# Altium schematic sheet SAMV71_Xplained_Ultra_Connectors.SchDoc: Extension connectors
size A3; Organization: ATMEL Norway; Address1: Vestre Rosten 79; Address2: N-7075 TILLER; Address3: NORWAY; DocumentNumber: A09-2407; Revision: 2; SheetNumber: 7; SheetTotal: 13; PageSetup: Record=PageOptions|CenterHorizontal=True|CenterVertical=True|PrintScale=1.01|XCorrection=1.00|YCorrection=1.00|PrintKind=1|BorderSize=5000000|LeftOffset=0|BottomOffset=0|Orientation=2|PaperLength=1000|PaperWidth=1000|Scale=100|PaperSource=7|PrintQuality=-4|MediaType=1|DitherType=10|PrintScaleMode=1|PaperKind=A3 (297 x 420 mm)|PaperIndex=9
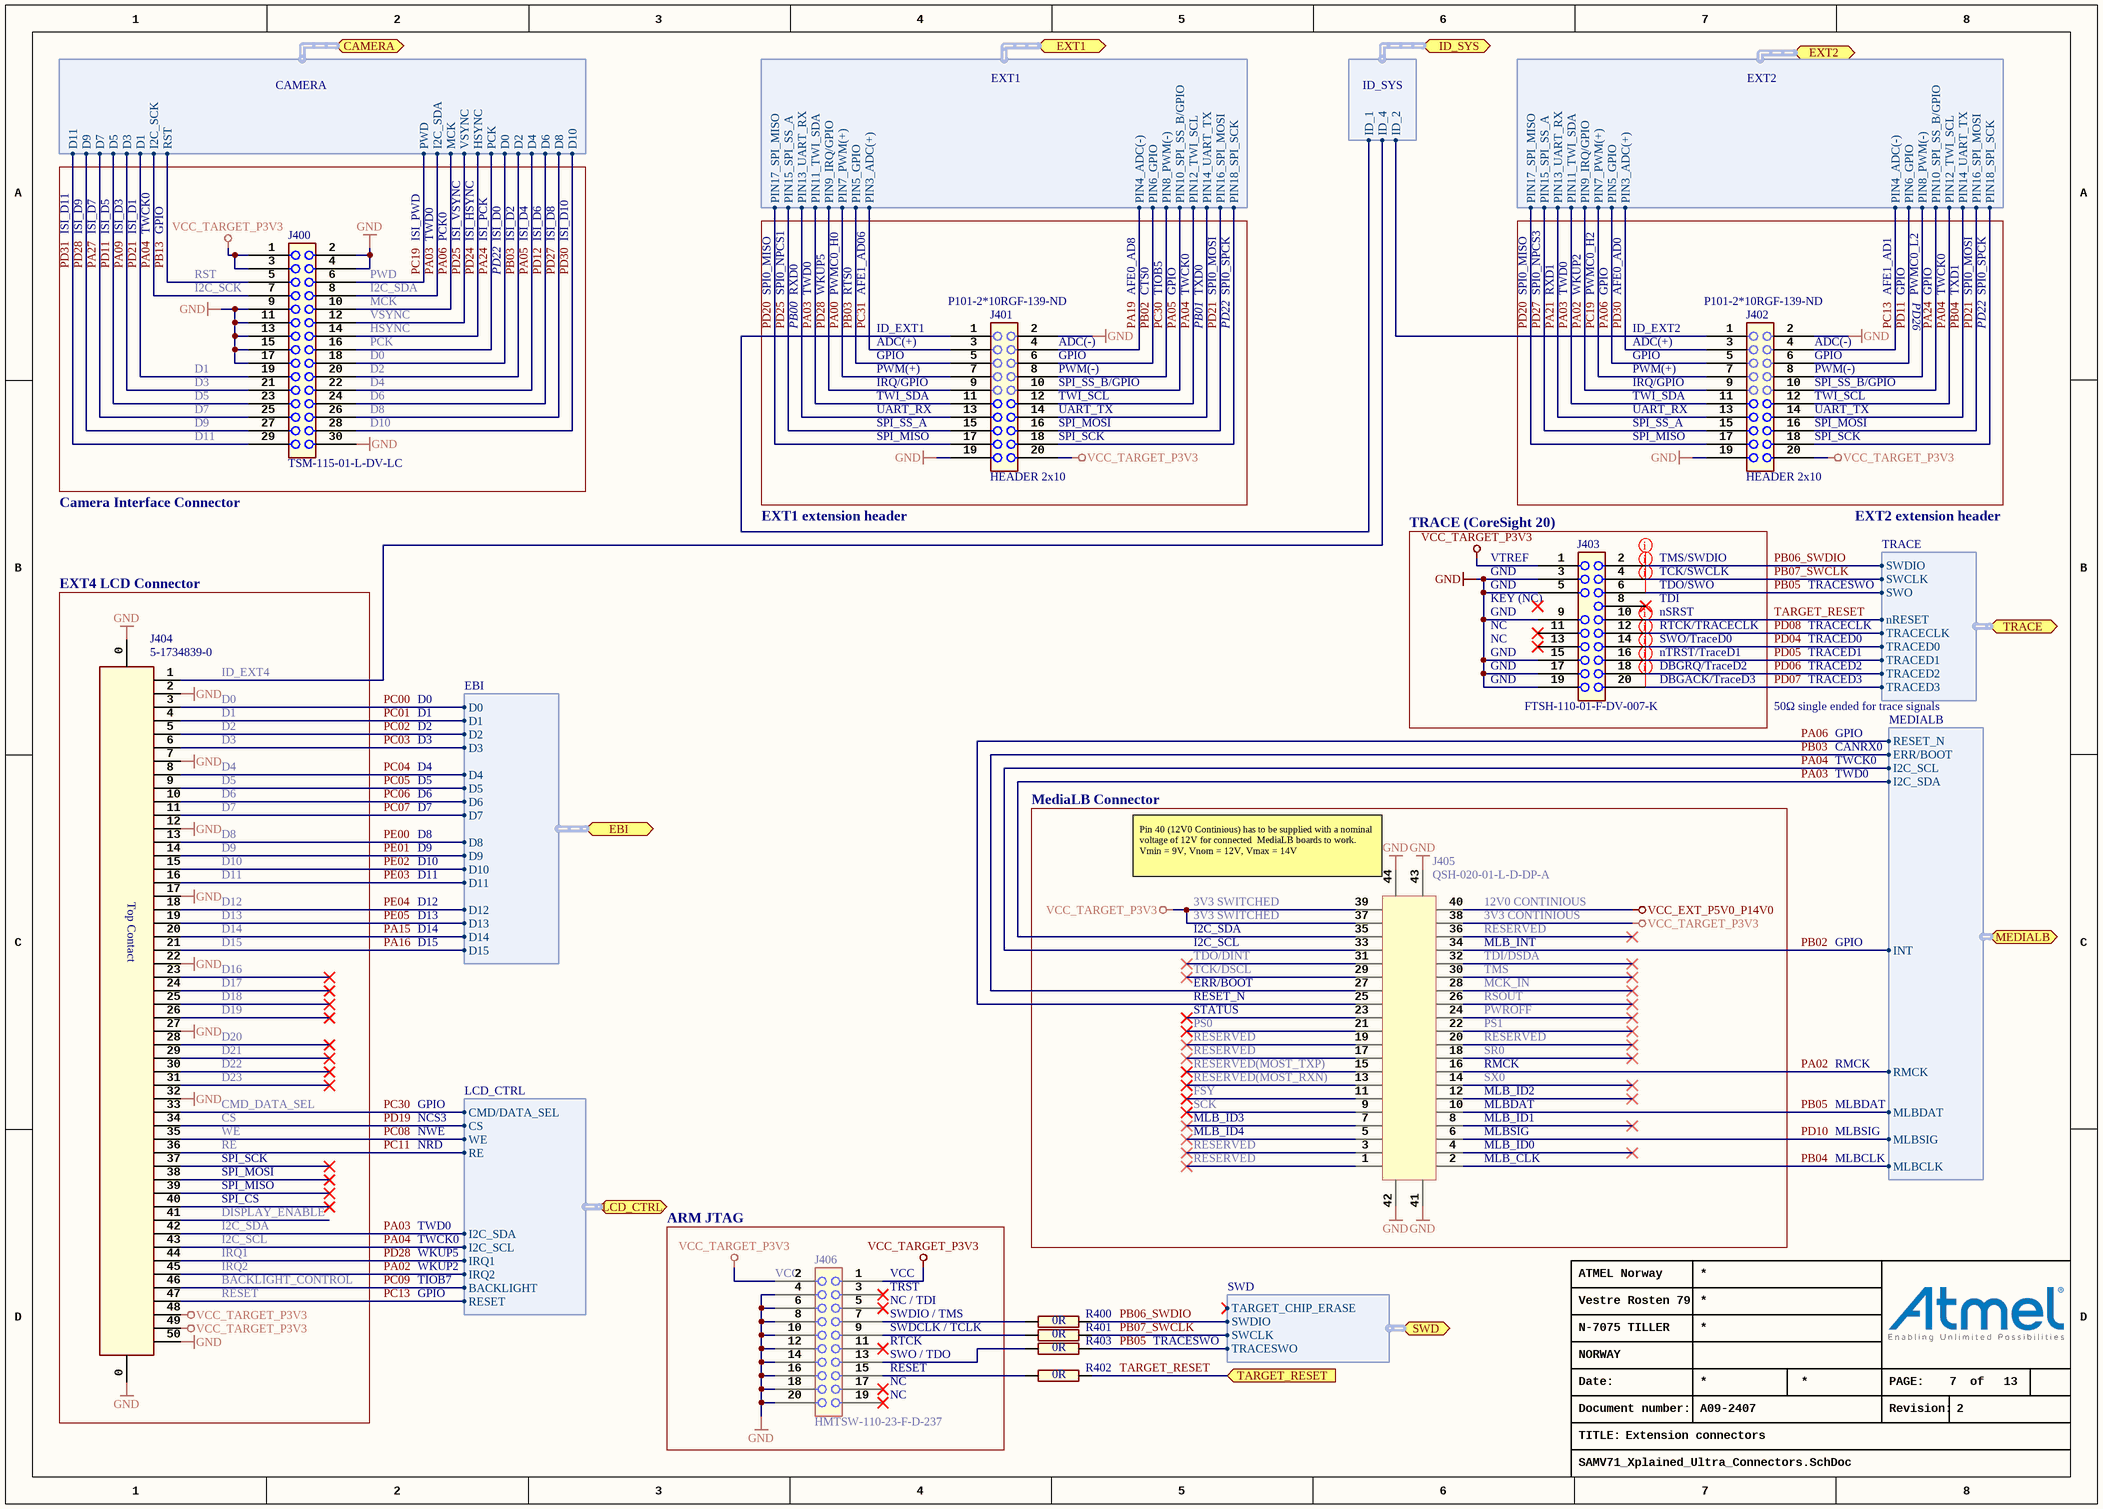
[diagram p0: SAMV71_Xplained_Ultra_Connectors.SchDoc]

## Parts
J400  value TSM-115-01-L-DV-LC  [AP8-00884]  (hidden comment: HEADER 2x15)
J401  HEADER 2x10  value P101-2*10RGF-139-ND  [AP8-00622]
J402  HEADER 2x10  value P101-2*10RGF-139-ND  [AP8-00622]
J403  FTSH-110-01-F-DV-007-K  [AP8-00910]
J404  value 5-1734839-0  [AP8-00774]  (hidden comment: Used for Xplained Pro MCU board on top layer.)
J405  value QSH-020-01-L-D-DP-A  [AP8-00878]
J406  value HMTSW-110-23-F-D-237  [AP8-00744]  (hidden comment: Same as A08-1514 but with 1mm hole)
R400  value 0R  [AP2-00000]  (hidden comment: R2)
R401  value 0R  [AP2-00000]  (hidden comment: R2)
R402  value 0R  [AP2-00000]  (hidden comment: R2)
R403  value 0R  [AP2-00000]  (hidden comment: R2)

## Blocks framed on the sheet
TRACE (CoreSight 20): J403
EXT4 LCD Connector: J404
MediaLB Connector: J405
ARM JTAG: J406

## Ports
CAMERA (harness CAMERA), EBI (harness EBI), EXT1 (harness EXT1), EXT2 (harness EXT2), ID_SYS (harness ID_SYS), LCD_CTRL (harness LCD_CTRL), MEDIALB (harness MEDIALB), SWD (harness SWD), TARGET_RESET (in), TRACE (harness TRACE)

## Harnesses
ID_SYS: ID_1, ID_2, ID_4
EXT1: PIN3_ADC(+), PIN4_ADC(-), PIN5_GPIO, PIN6_GPIO, PIN7_PWM(+), PIN8_PWM(-), PIN9_IRQ/GPIO, PIN10_SPI_SS_B/GPIO, PIN11_TWI_SDA, PIN12_TWI_SCL, PIN13_UART_RX, PIN14_UART_TX, PIN15_SPI_SS_A, PIN16_SPI_MOSI, PIN17_SPI_MISO, PIN18_SPI_SCK
EXT2: PIN3_ADC(+), PIN4_ADC(-), PIN5_GPIO, PIN6_GPIO, PIN7_PWM(+), PIN8_PWM(-), PIN9_IRQ/GPIO, PIN10_SPI_SS_B/GPIO, PIN11_TWI_SDA, PIN12_TWI_SCL, PIN13_UART_RX, PIN14_UART_TX, PIN15_SPI_SS_A, PIN16_SPI_MOSI, PIN17_SPI_MISO, PIN18_SPI_SCK
EBI: D0, D1, D2, D3, D4, D5, D6, D7, D8, D9, D10, D11, D12, D13, D14, D15
CAMERA: MCK, VSYNC, HSYNC, PCK, D0, D1, D2, D3, D4, D5, D6, D7, D8, D9, D10, D11, I2C_SCK, I2C_SDA, RST, PWD
TRACE: SWDIO, SWCLK, TRACECLK, TRACED0, TRACED1, TRACED2, TRACED3, nRESET, SWO
LCD_CTRL: CMD/DATA_SEL, CS, WE, RE, I2C_SDA, I2C_SCL, IRQ1, IRQ2, BACKLIGHT, RESET
MEDIALB: MLBSIG, MLBDAT, MLBCLK, I2C_SDA, I2C_SCL, INT, ERR/BOOT, RESET_N, RMCK
SWD: SWCLK, SWDIO, TARGET_CHIP_ERASE, TRACESWO

## Nets
GND: J400.2 J400.4 J400.9 J400.11 J400.13 J400.15 J400.17 J400.30 J401.2 J401.19 J402.2 J402.19 J403.3 J403.5 J403.9 J403.15 J403.17 J403.19 J404.0 J404.2 J404.7 J404.12 J404.17 J404.22 J404.27 J404.32 J404.50 J405.41 J405.42 J405.43 J405.44 J406.4 J406.6 J406.8 J406.10 J406.12 J406.14 J406.16 J406.18 J406.20
VCC_EXT_P5V0_P14V0: J405.40
VCC_TARGET_P3V3: J400.1 J400.3 J401.20 J402.20 J403.1 J404.48 J404.49 J405.37 J405.38 J405.39 J406.1 J406.2
PA00: J401.7 ; port EXT1.PIN7_PWM(+)
PA02: J402.9 J404.45 J405.16 ; port EXT2.PIN9_IRQ/GPIO, port LCD_CTRL.IRQ2, port MEDIALB.RMCK
PA03: J400.8 J401.11 J402.11 J404.42 J405.35 ; port EXT1.PIN11_TWI_SDA, port EXT2.PIN11_TWI_SDA, port CAMERA.I2C_SDA, port LCD_CTRL.I2C_SDA, port MEDIALB.I2C_SDA
PA04: J400.7 J401.12 J402.12 J404.43 J405.33 ; port EXT1.PIN12_TWI_SCL, port EXT2.PIN12_TWI_SCL, port CAMERA.I2C_SCK, port LCD_CTRL.I2C_SCL, port MEDIALB.I2C_SCL
PA05: J400.22 J401.10 ; port EXT1.PIN10_SPI_SS_B/GPIO, port CAMERA.D4
PA06: J400.10 J402.5 J405.25 ; port EXT2.PIN5_GPIO, port CAMERA.MCK, port MEDIALB.RESET_N
PA09: J400.21 ; port CAMERA.D3
PA15: J404.20 ; port EBI.D14
PA16: J404.21 ; port EBI.D15
PA19: J401.4 ; port EXT1.PIN4_ADC(-)
PA21: J402.13 ; port EXT2.PIN13_UART_RX
PA24: J400.16 J402.10 ; port EXT2.PIN10_SPI_SS_B/GPIO, port CAMERA.PCK
PA27: J400.25 ; port CAMERA.D7
PB02: J401.6 J405.34 ; port EXT1.PIN6_GPIO, port MEDIALB.INT
PB03: J400.20 J401.5 J405.27 ; port EXT1.PIN5_GPIO, port CAMERA.D2, port MEDIALB.ERR/BOOT
PB04: J402.14 J405.2 ; port EXT2.PIN14_UART_TX, port MEDIALB.MLBCLK
PB05: J403.6 J405.10 R403.2 ; port TRACE.SWO, port MEDIALB.MLBDAT, port SWD.TRACESWO
PB06_SWDIO: J403.2 R400.2 ; port TRACE.SWDIO, port SWD.SWDIO
PB07_SWCLK: J403.4 R401.2 ; port TRACE.SWCLK, port SWD.SWCLK
PB13: J400.5 ; port CAMERA.RST
PC00: J404.3 ; port EBI.D0
PC01: J404.4 ; port EBI.D1
PC02: J404.5 ; port EBI.D2
PC03: J404.6 ; port EBI.D3
PC04: J404.8 ; port EBI.D4
PC05: J404.9 ; port EBI.D5
PC06: J404.10 ; port EBI.D6
PC07: J404.11 ; port EBI.D7
PC08: J404.35 ; port LCD_CTRL.WE
PC09: J404.46 ; port LCD_CTRL.BACKLIGHT
PC11: J404.36 ; port LCD_CTRL.RE
PC13: J402.4 J404.47 ; port EXT2.PIN4_ADC(-), port LCD_CTRL.RESET
PC19: J400.6 J402.7 ; port EXT2.PIN7_PWM(+), port CAMERA.PWD
PC30: J401.8 J404.33 ; port EXT1.PIN8_PWM(-), port LCD_CTRL.CMD/DATA_SEL
PC31: J401.3 ; port EXT1.PIN3_ADC(+)
PD04: J403.14 ; port TRACE.TRACED0
PD05: J403.16 ; port TRACE.TRACED1
PD06: J403.18 ; port TRACE.TRACED2
PD07: J403.20 ; port TRACE.TRACED3
PD08: J403.12 ; port TRACE.TRACECLK
PD10: J405.6 ; port MEDIALB.MLBSIG
PD11: J400.23 J402.6 ; port EXT2.PIN6_GPIO, port CAMERA.D5
PD12: J400.24 ; port CAMERA.D6
PD19: J404.34 ; port LCD_CTRL.CS
PD20: J401.17 J402.17 ; port EXT1.PIN17_SPI_MISO, port EXT2.PIN17_SPI_MISO
PD21: J400.19 J401.16 J402.16 ; port EXT1.PIN16_SPI_MOSI, port EXT2.PIN16_SPI_MOSI, port CAMERA.D1
PD24: J400.14 ; port CAMERA.HSYNC
PD25: J400.12 J401.15 ; port EXT1.PIN15_SPI_SS_A, port CAMERA.VSYNC
PD27: J400.26 J402.15 ; port EXT2.PIN15_SPI_SS_A, port CAMERA.D8
PD28: J400.27 J401.9 J404.44 ; port EXT1.PIN9_IRQ/GPIO, port CAMERA.D9, port LCD_CTRL.IRQ1
PD30: J400.28 J402.3 ; port EXT2.PIN3_ADC(+), port CAMERA.D10
PD31: J400.29 ; port CAMERA.D11
PE00: J404.13 ; port EBI.D8
PE01: J404.14 ; port EBI.D9
PE02: J404.15 ; port EBI.D10
PE03: J404.16 ; port EBI.D11
PE04: J404.18 ; port EBI.D12
PE05: J404.19 ; port EBI.D13
TARGET_RESET: J403.10 R402.2 ; port TARGET_RESET, port TRACE.nRESET
NetJ400_18: J400.18 ; port CAMERA.D0
NetJ401_1: J401.1 ; port ID_SYS.ID_1
NetJ401_13: J401.13 ; port EXT1.PIN13_UART_RX
NetJ401_14: J401.14 ; port EXT1.PIN14_UART_TX
NetJ401_18: J401.18 ; port EXT1.PIN18_SPI_SCK
NetJ402_1: J402.1 ; port ID_SYS.ID_2
NetJ402_8: J402.8 ; port EXT2.PIN8_PWM(-)
NetJ402_18: J402.18 ; port EXT2.PIN18_SPI_SCK
NetJ404_1: J404.1 ; port ID_SYS.ID_4
NetJ406_7: J406.7 R400.1
NetJ406_9: J406.9 R401.1
NetJ406_13: J406.13 R403.1
NetJ406_15: J406.15 R402.1

Not connected (* = marked no-connect by the designer): J403 8* 11* 13*; J404 23* 24* 25* 26* 28* 29* 30* 31* 37* 38* 39* 40* 41; J405 1* 3* 4* 5* 7* 8* 9* 11* 12* 13* 14* 15* 17* 18* 19* 20* 21* 22* 23* 24* 26* 28* 29* 30* 31* 32* 36*; J406 3* 5* 11* 17* 19*

## Layout directives
net class TRACE: PB05, PB06_SWDIO, PB07_SWCLK, PD04, PD05, PD06, PD07, PD08

## Notes on the sheet
- ISI_D11
- ISI_D9
- ISI_D7
- ISI_D5
- ISI_D3
- ISI_D1
- TWCK0
- GPIO
- ISI_PWD
- TWD0
- PCK0
- ISI_VSYNC
- ISI_HSYNC
- ISI_PCK
- ISI_D0
- ISI_D2
- ISI_D4
- ISI_D6
- ISI_D8
- ISI_D10
- RST
- (near J400) I2C_SCK
- PWD
- I2C_SDA
- MCK
- VSYNC
- PD22
- SPI0_MISO
- SPI0_NPCS1
- RXD0
- WKUP5
- PWMC0_H0
- RTS0
- AFE1_AD06
- AFE0_AD8
- CTS0
- TIOB5
- TXD0
- SPI0_MOSI
- SPI0_SPCK
- SPI0_NPCS3
- RXD1
- WKUP2
- PWMC0_H2
- AFE0_AD0
- AFE1_AD1
- PD26
- PWMC0_L2
- TXD1
- D1
- HSYNC
- PCK
- D0
- D2
- PB00
- ID_EXT1
- ADC(+)
- PWM(+)
- (near J401) ADC(-)
- (near J401) GPIO
- (near J401) PWM(-)
- PB01
- ID_EXT2
- (near J402) ADC(-)
- (near J402) GPIO
- (near J402) PWM(-)
- D3
- D5
- D7
- D9
- D11
- D4
- D6
- D8
- D10
- IRQ/GPIO
- TWI_SDA
- UART_RX
- SPI_SS_A
- SPI_MISO
- (near J401) SPI_SS_B/GPIO
- (near J401) TWI_SCL
- (near J401) UART_TX
- (near J401) SPI_MOSI
- (near J401) SPI_SCK
- (near J402) SPI_SS_B/GPIO
- (near J402) TWI_SCL
- (near J402) UART_TX
- (near J402) SPI_MOSI
- (near J402) SPI_SCK
- Camera Interface Connector
- EXT1 extension header
- VTREF
- GND
- TMS/SWDIO
- TCK/SWCLK
- TDO/SWO
- TRACESWO
- EXT2 extension header
- (near J403) KEY (NC)
- NC
- TDI
- nSRST
- SWO/TraceD0
- RTCK/TRACECLK
- TRACECLK
- TRACED0
- ID_EXT4
- nTRST/TraceD1
- DBGRQ/TraceD2
- DBGACK/TraceD3
- 50Ω single ended for trace signals
- TRACED1
- TRACED2
- TRACED3
- CANRX0
- D12
- D13
- (near J405) Pin 40 (12V0 Continious) has to be supplied with a nominal voltage of 12V for connected  MediaLB boards to work.  Vmin = 9V, Vnom = 12V, Vmax = 14V
- 3V3 SWITCHED
- (near J405) 3V3 CONTINIOUS
- (near J405) 12V0 CONTINIOUS
- D14
- D15
- D16
- D17
- TCK/DSCL
- TDO/DINT
- ERR/BOOT
- I2C_SCL
- (near J405) TMS
- (near J405) TDI/DSDA
- (near J405) RESERVED
- (near J405) MCK_IN
- (near J405) MLB_INT
- D18
- D19
- D20
- D21
- RESERVED
- PS0
- STATUS
- RESET_N
- (near J405) SR0
- (near J405) RSOUT
- (near J405) PWROFF
- (near J405) PS1
- D22
- D23
- CMD_DATA_SEL
- CS
- NCS3
- SCK
- FSY
- RESERVED(MOST_RXN)
- RESERVED(MOST_TXP)
- MLB_ID3
- (near J405) SX0
- (near J405) RMCK
- (near J405) MLBDAT
- (near J405) MLB_ID2
- (near J405) MLB_ID1
- RMCK
- MLBDAT
- WE
- RE
- SPI_MOSI
- SPI_SCK
- NWE
- NRD
- MLB_ID4
- (near J405) MLBSIG
- (near J405) MLB_ID0
- (near J405) MLB_CLK
- MLBSIG
- MLBCLK
- DISPLAY_ENABLE
- IRQ1
- SPI_CS
- IRQ2
- BACKLIGHT_CONTROL
- RESET
- TIOB7
- (near J406) VCC
- (near J406) TRST
- (near J406) NC / TDI
- (near J406) SWDIO / TMS
- SWDCLK / TCLK
- (near J406) RTCK
- (near J406) SWO / TDO
- (near J406) RESET
- (near J406) NC
- Date:
- PAGE:
- of
- TITLE:
- Document number:
- Revision:
- (in symbol A08-1886) Top Contact

## Library data of the parts
J400 = A08-2225: Samtec TSM series, 2x15 pin header, straight, 2.54mm pitch SMD, locking leads.; PartGroup: Mechanical devices,Connectors,Pin headers; TemperatureRange: -55Â°C to +125Â°C; AN: A08-2225; Height: 9,64999961853027
J401 J402 = A08-1513: Pin header, 2x10, Right Angle, 2.54mm, THM, Pin In Paste; PartGroup: Mechanical devices,Connectors,Pin headers; AN: A08-1513; MPN: P101-2*10RGF-139-ND
J403 = A08-2290: SAMTEC FTSH series 50-mil header, shrouded, pin 7 removed, SMD; PartGroup: Mechanical devices,Connectors,Pin headers; TemperatureRange: -55Â°C to +125Â°C; AN: A08-2290; Value: FTSH-110-01-F-DV-007-K; Height: 6,1100001335144
J404 = A08-1886: 50 pin FPC connector, e=0.5mm, single side contact (top).; PartGroup: Mechanical devices,Connectors,PCB - receptacle; Manufacturer: TE Connectivity; TemperatureRange: -20°C to +85°C; AN: A08-1886; Height: 2.04999995231628; MPN: 5-1734839-0
J405 = A08-2204: SAMTEC 0.5mm, 20-pair, High-Speed Differential Pair Socket; PartGroup: Mechanical devices,Connectors,PCB - receptacle; AN: A08-2204; Height: 3.04999995231628
J406 = A08-1801: 2x10 pin header, 2.54mm pitch, Pin-in-Paste THM, 1mm hole; PartGroup: Mechanical devices,Connectors,Pin headers; Manufacturer: SAMTEC; AN: A08-1801; Height: 6,09999990463257; MPN: HMTSW-110-23-F-D-237
R400-R403 = A02-0163: RES 0.0 OHM 1/16W 0402 SMD; PartGroup: Resistors,SMD,0402 1%; Manufacturer: (n/a); MPN: RMCF0402ZT0R00; Tolerance: 1 %; TemperatureRange: -55 - +125 deg C; AN: A02-0163; Height: 0,349999994039536